# EAGLE design Schematics_Rev_2 (EAGLE 9.3.0)
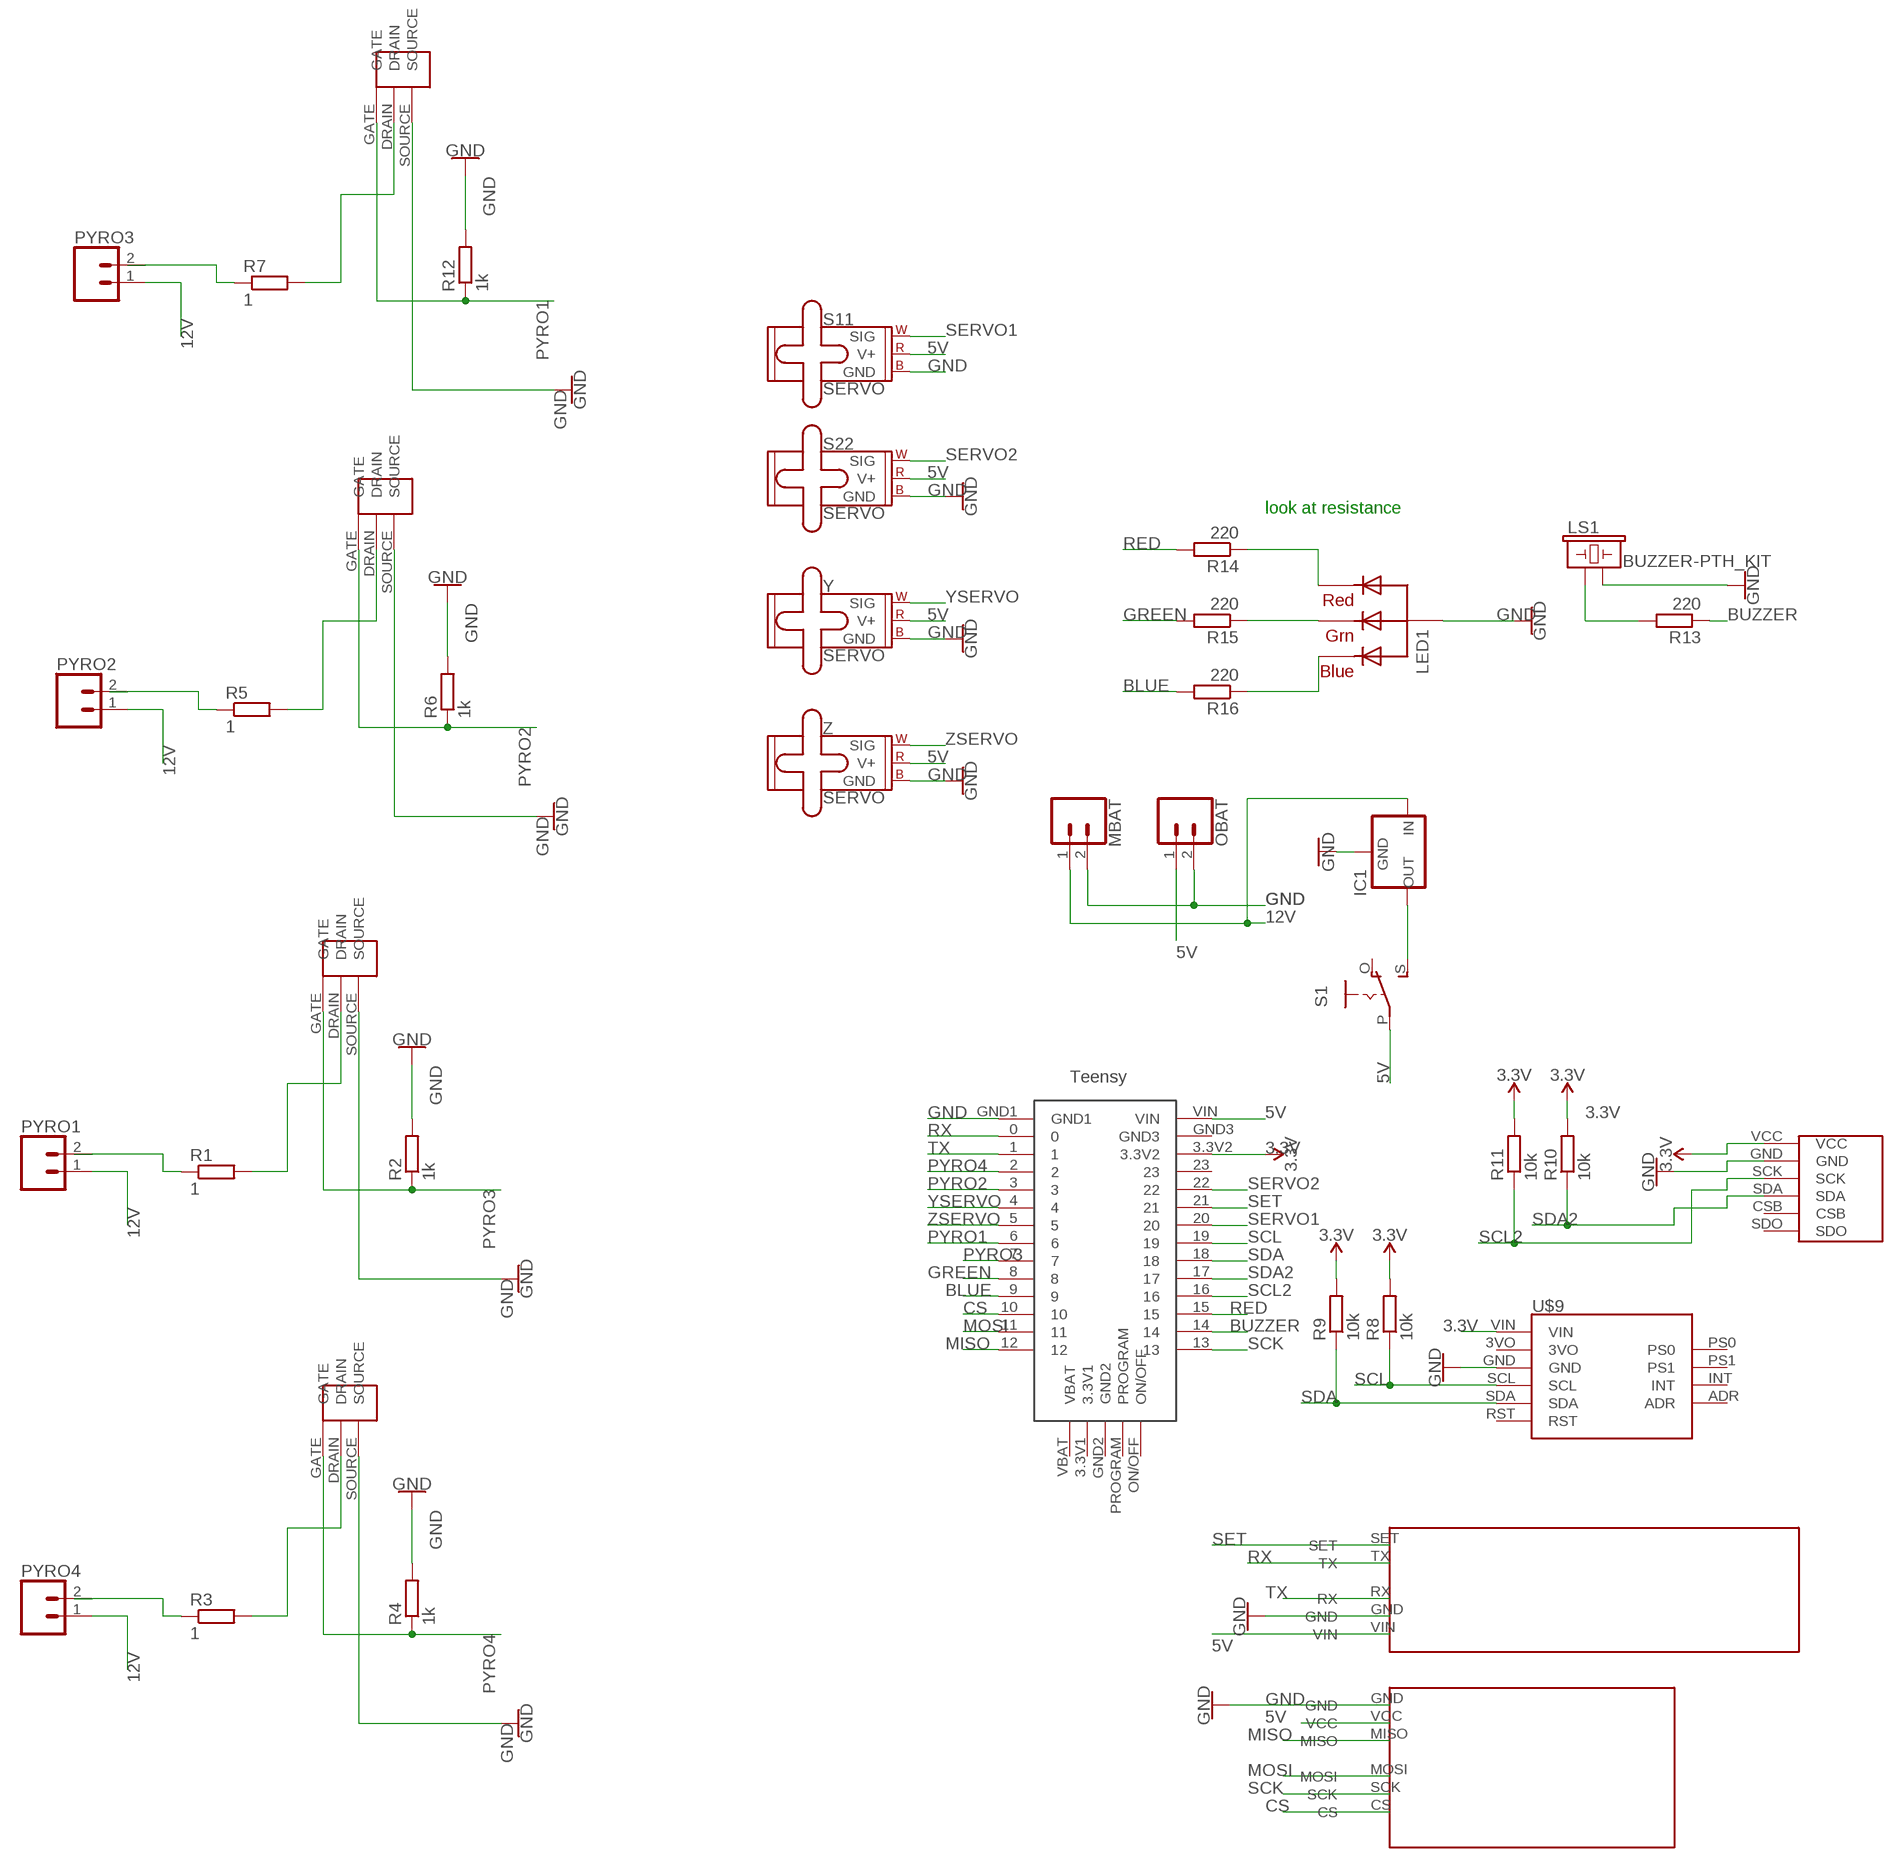
[diagram p0: schematic, sheet 1]

## Parts
IC1  78XXS  [78XXS]
LED1  RGBLED_CA-5MM  [LED5MMRGB]
LS1  BUZZER-PTH_KIT  [BUZZER-12MM-KIT]
MBAT  CONN_023.5MM  [SCREWTERMINAL-3.5MM-2]
OBAT  CONN_023.5MM  [SCREWTERMINAL-3.5MM-2]
PYRO1  CONN_023.5MM  [SCREWTERMINAL-3.5MM-2]
PYRO2  CONN_023.5MM  [SCREWTERMINAL-3.5MM-2]
PYRO3  CONN_023.5MM  [SCREWTERMINAL-3.5MM-2]
PYRO4  CONN_023.5MM  [SCREWTERMINAL-3.5MM-2]
R1  1  R-EU_0204/7  [0204/7]
R2  1k  R-EU_0204/7  [0204/7]
R3  1  R-EU_0204/7  [0204/7]
R4  1k  R-EU_0204/7  [0204/7]
R5  1  R-EU_0204/7  [0204/7]
R6  1k  R-EU_0204/7  [0204/7]
R7  1  R-EU_0204/7  [0204/7]
R8  10k  R-EU_0204/7  [0204/7]
R9  10k  R-EU_0204/7  [0204/7]
R10  10k  R-EU_0204/7  [0204/7]
R11  10k  R-EU_0204/7  [0204/7]
R12  1k  R-EU_0204/7  [0204/7]
R13  220  R-EU_0204/7  [0204/7]
R14  220  R-EU_0204/7  [0204/7]
R15  220  R-EU_0204/7  [0204/7]
R16  220  R-EU_0204/7  [0204/7]
S1  EG1218S  [EG1218]
S11  SERVO  [1X03]
S22  SERVO  [1X03]
U$1  TEENSY-4.0  [TEENSY-4.0]
U$2  MICROSD  [MICROSD]
U$3  BMP280  [BMP280]
U$4  HC-12  [HC-12]
U$5  IRF520  [IRF520]
U$6  IRF520  [IRF520]
U$7  IRF520  [IRF520]
U$8  IRF520  [IRF520]
U$9  BNO-055  [BNO-055]
Y  SERVO  [1X03]
Z  SERVO  [1X03]

## Nets
3.3V: R8.2 R9.2 R10.2 R11.2 U$1.3.3V2 U$3.VCC U$9.VIN
5V: OBAT.1 S1.P S11.2(V+) S22.2(V+) U$1.VIN U$2.VCC U$4.VIN Y.2(V+) Z.2(V+)
12V: IC1.IN MBAT.1 PYRO1.1 PYRO2.1 PYRO3.1 PYRO4.1
29: LS1.+ R13.2
BLUE: R16.2 U$1.9
BUZZER: R13.1 U$1.14
CS: U$1.10 U$2.CS
GND: IC1.GND LED1.2(VCC) LS1.- MBAT.2 OBAT.2 R2.2 R4.2 R6.2 R12.2 S11.3(GND) S22.3(GND) U$1.GND1 U$2.GND U$3.GND U$4.GND U$5.SOURCE U$6.SOURCE U$7.SOURCE U$8.SOURCE U$9.GND Y.3(GND) Z.3(GND)
GREEN: R15.2 U$1.8
MISO: U$1.12 U$2.MISO
MOSI: U$1.11 U$2.MOSI
N$1: PYRO1.2 R1.1
N$2: R1.2 U$6.DRAIN
N$3: PYRO4.2 R3.1
N$4: R3.2 U$5.DRAIN
N$5: PYRO2.2 R5.1
N$6: R5.2 U$7.DRAIN
N$7: PYRO3.2 R7.1
N$8: R7.2 U$8.DRAIN
N$9: LED1.1(RED) R14.1
N$10: LED1.3(GREEN) R15.1
N$11: IC1.OUT S1.S
N$12: LED1.4(BLUE) R16.1
PYRO1: R12.1 U$1.6 U$8.GATE
PYRO2: R6.1 U$1.3 U$7.GATE
PYRO3: R2.1 U$1.7 U$6.GATE
PYRO4: R4.1 U$1.2 U$5.GATE
RED: R14.2 U$1.15
RX: U$1.0 U$4.TX
SCK: U$1.13 U$2.SCK
SCL: R8.1 U$1.19 U$9.SCL
SCL2: R11.1 U$1.16 U$3.SCK
SDA: R9.1 U$1.18 U$9.SDA
SDA2: R10.1 U$1.17 U$3.SDA
SERVO1: S11.1(SIG) U$1.20
SERVO2: S22.1(SIG) U$1.22
SET: U$1.21 U$4.SET
TX: U$1.1 U$4.RX
YSERVO: U$1.4 Y.1(SIG)
ZSERVO: U$1.5 Z.1(SIG)
Unconnected: S1.O U$1.3.3V1 U$1.23 U$1.GND2 U$1.GND3 U$1.ON/OFF U$1.PROGRAM U$1.VBAT U$3.CSB U$3.SDO U$9.3VO U$9.ADR U$9.INT U$9.PS0 U$9.PS1 U$9.RST

## Notes on the sheet
- look at resistance

## Library data of the parts
IC1 = v-reg:78XXS: VOLTAGE REGULATOR
LED1 = adafruit:RGBLED_CA: RGB LED, common-anode 5MM Staggered pins 5mm Piranha package http://www.ladyada.net/library/pcb/eaglelibrary.html
LS1 = SparkFun-Electromechanical:BUZZER: Buzzer Small round buzzers that operate around the audible 2kHz range. You can use these as speakers to create simple music or user interfaces. Variant Overview: PTH - Mini Speaker - PC Mount 12mm 2.048kHz <https://www.sparkfun.com/products/7950> PTH_KIT - Mini Speaker - PC Mount 12mm 2.048kHz <https://www.sparkfun.com/products/7950> KIT simplifies soldering by adding stop mask to one side of the pads. PTH_NO_SILK - Mini Speaker - PC Mount 12mm 2.048kHz <https://www.sparkfun.com/products/7950> No silkscreen indicator of buzzer outline. PTH_KIT_NO_SILK - Mini Speaker - PC Mount 12mm 2.048kHz <https://www.sparkfun.com/products/7950> KIT package w/o silkscreen SMD - Buzzer Audio Magnetic (CCV-084B16) SMD buzzer used on, e.g. the LilyPad Buzzer <https://www.sparkfun.com/products/8463> and RFID USB Reader <https://www.sparkfun.com/products/9963>. SMD_KIT - Buzzer Audio Magnetic (CCV-084B16) SMD Buzzer with elongated pins to make soldering easier. Used on the SparkFun Simon Says - Surface Mount Soldering Kit <https://www.sparkfun.com/products/10935>.; PROD_ID: COMP-08253; SF_SKU: COM-07950
MBAT OBAT PYRO1-PYRO4 = SparkFun-Retired:CONN_02: Multi connection point. Often used as Generic Header-pin footprint for 0.1 inch spaced/style header connections On any of the 0.1 inch spaced packages, you can populate with these: Break Away Headers - Straight <https://www.sparkfun.com/products/116> (PRT-00116) Break Away Male Headers - Right Angle <https://www.sparkfun.com/products/553> (PRT-00553) Female Headers <https://www.sparkfun.com/products/115> (PRT-00115) Break Away Headers - Machine Pin <https://www.sparkfun.com/products/117> (PRT-00117) Break Away Female Headers - Swiss Machine Pin <https://www.sparkfun.com/products/743> (PRT-00743) For SCREWTERMINALS and SPRING TERMINALS visit here: Screw Terimnals on SparkFun.com <https://www.sparkfun.com/search/results?term=Screw+Terminals> (5mm/3.5mm/2.54mm spacing) This device is also useful as a general connection point to wire up your design to another part of your project. Our various solder wires solder well into these plated through hole pads. Hook-Up Wire - Assortment (Stranded, 22 AWG) <https://www.sparkfun.com/products/11375> (PRT-11375) Hook-Up Wire - Assortment (Solid Core, 22 AWG) <https://www.sparkfun.com/products/11367> (PRT-11367) View the entire wire category on our website here <https://www.sparkfun.com/categories/141> Special notes: Molex polarized connector foot print use with: PRT-08233 with associated crimp pins and housings. 2.54_SCREWTERM for use with PRT-10571. 3.5mm Screw Terminal footprints for PRT-08084 5mm Screw Terminal footprints for use with PRT-08432; PROD_ID: CONN-08399
R1-R16 = rcl:R-EU_: RESISTOR, European symbol; SPICEPREFIX: R
S1 = adafruit:EG1218: SLIDING SWITCH 0.1" spacing through hole, vertical SPDT slide switch http://www.ladyada.net/library/pcb/eaglelibrary.html
S11 S22 Y Z = SparkFun-Electromechanical:SERVO: Servo Motor 3-pin connector for a standard servo motor (voltage supply, ground, and control signal.) SparkFun Products Servo - Generic (Sub-Micro Size) <https://www.sparkfun.com/products/9065> (ROB-09065) Servo - Generic High Torque Continuous Rotation (Standard Size) <https://www.sparkfun.com/products/9347> (ROB-09347) Servo - Generic High Torque (Standard Size) <https://www.sparkfun.com/products/11965> (ROB-11965)
U$1 = Endeavour-PCB:TEENSY-4.0
U$2 = microsd:MICROSD
U$3 = BMP280:BMP280
U$4 = hc-12:HC-12
U$5-U$8 = IRF520:IRF520
U$9 = Endeavour-PCB:BNO-055

## Board
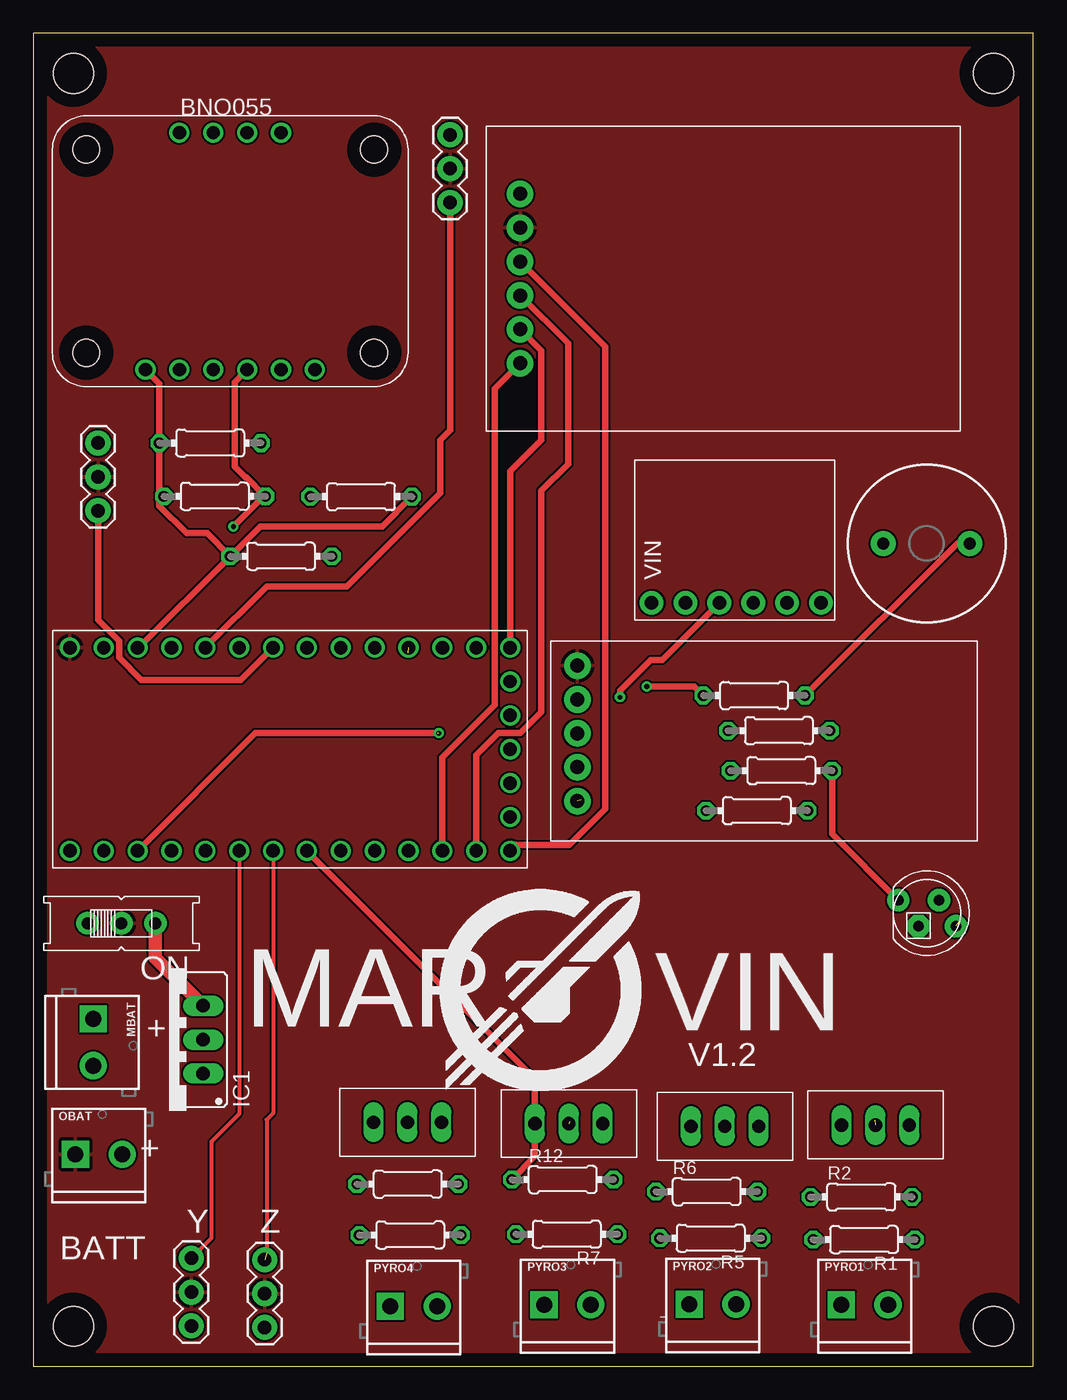
[diagram p1: board, top side]
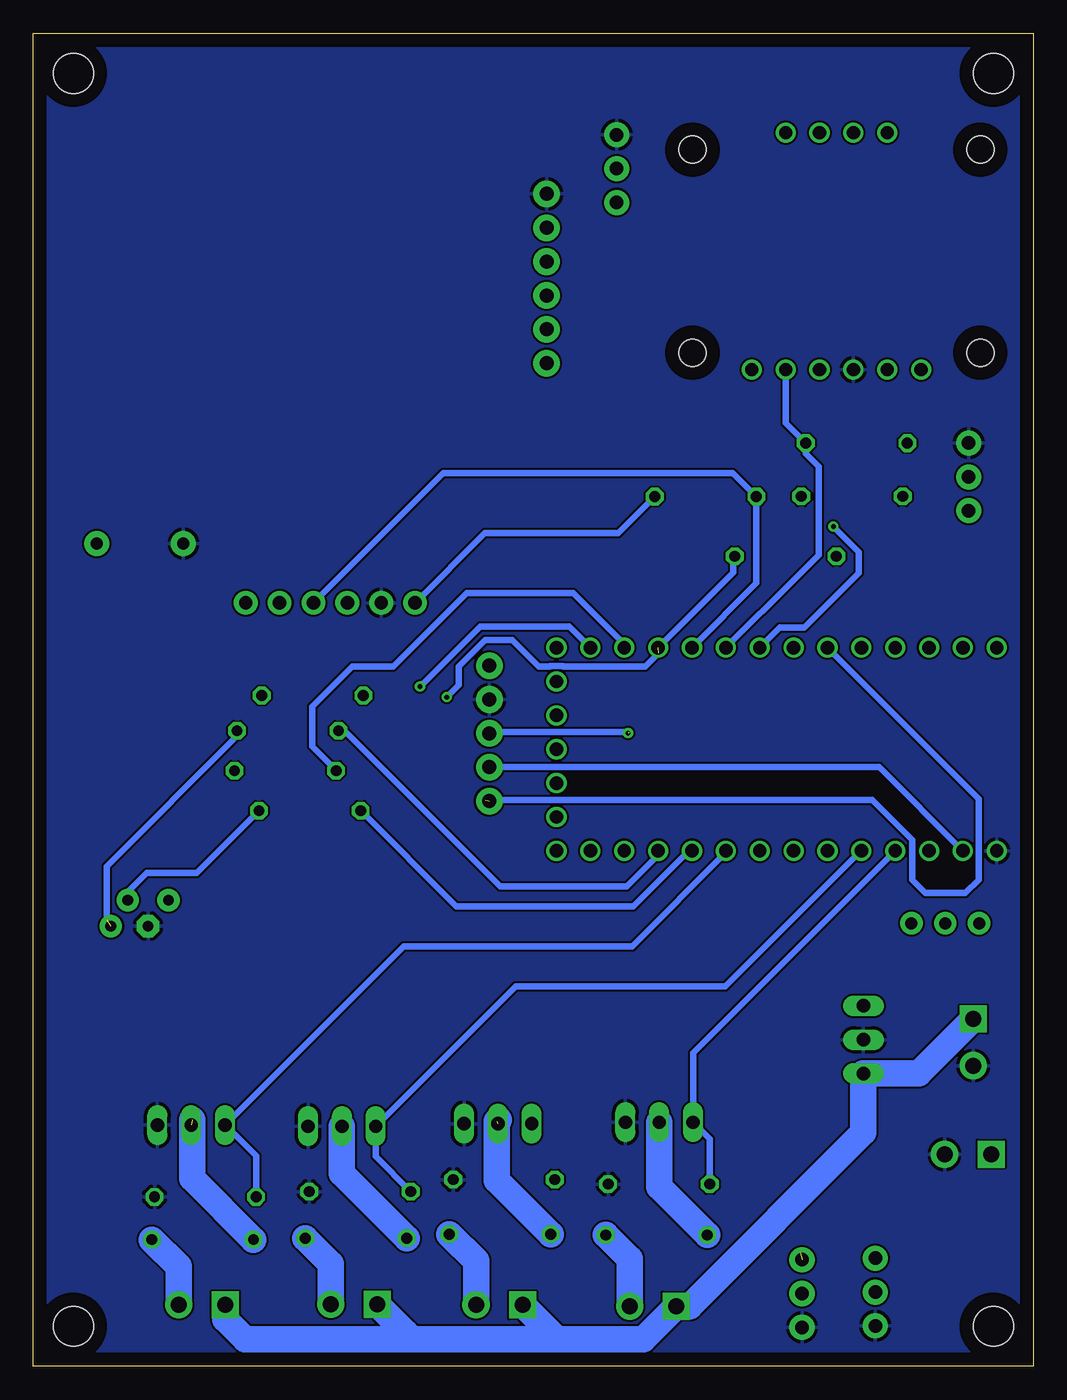
[diagram p2: board, bottom side, seen from below]

Size 75 x 100 mm. Coordinates in mm from the lower left corner, seen from the top.
Outline: 0,0 75,0 75,100 0,100 0,0
Copper layers (1*16): Top 0.035mm / dielectric 1.5mm / Bottom 0.035mm
Design rules "default": minimum track width 6mil, minimum drill 0.35mm, track to track 6mil, track to pad 6mil, pad to pad 6mil, via to via 6mil, smd to smd 6mil, copper to edge 40mil, drill to drill 6mil, minimum pad ring 10mil, minimum via ring 8mil, stop-mask expansion 4mil, vias tented up to drill 0mil, thermal gap 10mil
Holes 3 mm at 3,3 72,3 72,97 3,97

### Footprints (pad centres in the part's own frame; a part is rotated, then mirrored left to right if it is on the bottom)
78XXS = drill 1.016 long: GND 0,-2.54; IN -2.54,-2.54; OUT 2.54,-2.54
LED5MMRGB = drill 0.8 pad 1.676: 1 -2.159,0.968; 3 0.889,0.968; 4 2.159,-0.968 | drill 0.8 pad 1.676 octagon: 2 -0.635,-0.968
BUZZER-12MM-KIT = drill 0.9 pad 1.88: + 3.25,0; - -3.25,0
SCREWTERMINAL-3.5MM-2 = drill 1.2 pad 2.032 square: 1 0,0 | drill 1.2 pad 2.032: 2 3.5,0
0204/7 = drill 0.813 octagon: 1 -3.81,0; 2 3.81,0
EG1218 = drill 0.9 pad 1.676: O -2.54,0; P 0,0; S 2.54,0
1X03 = drill 1.016 pad 1.88: 1 0,0; 2 2.54,0; 3 5.08,0
TEENSY-4.0 = drill 1: 0 3.81,1.27; 1 6.35,1.27; 2 8.89,1.27; 3 11.43,1.27; 3.3V1 34.29,6.35; 3.3V2 6.35,16.51; 4 13.97,1.27; 5 16.51,1.27; 6 19.05,1.27; 7 21.59,1.27; 8 24.13,1.27; 9 26.67,1.27; 10 29.21,1.27; 11 31.75,1.27; 12 34.29,1.27; 13 34.29,16.51; 14 31.75,16.51; 15 29.21,16.51; 16 26.67,16.51; 17 24.13,16.51; 18 21.59,16.51; 19 19.05,16.51; 20 16.51,16.51; 21 13.97,16.51; 22 11.43,16.51; 23 8.89,16.51; GND1 1.27,1.27; GND2 34.29,8.89; GND3 3.81,16.51; ON/OFF 34.29,13.97; PROGRAM 34.29,11.43; VBAT 34.29,3.81; VIN 1.27,16.51
MICROSD = drill 1.05 pad 2: CS 0,0; GND 0,12.7; MISO 0,7.62; MOSI 0,5.08; SCK 0,2.54; VCC 0,10.16
BMP280 = drill 1 pad 1.784: CSB 11.43,1.27; GND 3.81,1.27; SCK 6.35,1.27; SDA 8.89,1.27; SDO 13.97,1.27; VCC 1.27,1.27
HC-12 = drill 1.05 pad 2: GND 0,7.62; RX 0,5.08; SET 0,0; TX 0,2.54; VIN 0,10.16
IRF520 = drill 1 long: DRAIN 0,2.54; GATE 0,5.08; SOURCE 0,0
BNO-055 = drill 1: 3VO -17.145,1.27; ADR -9.525,19.05; GND -14.605,1.27; INT -12.065,19.05; PS0 -17.145,19.05; PS1 -14.605,19.05; RST -6.985,1.27; SCL -12.065,1.27; SDA -9.525,1.27; VIN -19.685,1.27 | hole 2.032: -24.13,17.78; -2.54,17.78; -2.54,2.54; -24.13,2.54

### Placement (x,y rotation side)
IC1  10.2,24.5 90 top
LED1  67.03,33.99 0 top
LS1  66.99,61.73 0 top
MBAT  4.5,26.05 270 top
OBAT  3.16,15.9 0 top
PYRO1  60.6,4.6 0 top
PYRO2  49.2,4.65 0 top
PYRO3  38.3,4.6 0 top
PYRO4  26.78,4.5 0 top
R1  62.3,9.5 180 top
R2  62.1,12.7 0 top
R3  28.26,9.84 180 top
R4  28.08,13.66 0 top
R5  50.8,9.6 180 top
R6  50.5,13.1 0 top
R7  40,9.9 180 top
R8  13.6,65.26 180 top
R9  13.26,69.26 180 top
R10  24.58,65.24 0 top
R11  18.58,60.76 180 top
R12  39.7,14 0 top
R13  54.06,50.32 0 top
R14  56.1,44.68 180 top
R15  54.26,41.68 180 top
R16  55.92,47.68 180 top
S1  6.61,33.23 0 top
S11  4.85,64.18 90 top
S22  31.25,87.31 90 top
U$1  1.47,37.4 0 top
U$2  36.51,75.25 0 top
U$3  45.1,56 0 top
U$4  40.8,42.4 0 top
U$5  30.6,18.3 90 top
U$6  65.7,18.1 90 top
U$7  54.4,18 90 top
U$8  42.7,18.2 90 top
U$9  28.1,73.5 0 top
Y  11.85,8.1 270 top
Z  17.35,7.99 270 top

### Tracks (layer width: path | path; a pad name or v marks a point on that pad's centre or on a via)
3.3V
  Top 0.5: U$1.3.3V2 7.91,53.91 R11.2 | R11.2 13.03,62.5 11.5,62.5 9.45,64.55 R9.2 | R9.2 9.45,65.6 R8.2 | R11.2 17.01,63 26.15,63 R10.2 | R9.2 9.45,73.73 U$9.VIN
  Bottom 0.5: R10.2 31.13,62.5 41.14,62.5 U$3.VCC
5V
  pour Top: -3,4 -3,-6 -4.5,-7.5 83.5,-7.5 86,-10 86,112 88,114 -8,114 -11.5,110.5 -11.5,12.5
12V
  Bottom 2: MBAT.1 8.59,21.96 IC1.IN 12.74,17.54 25.78,4.5 PYRO4.1 29.26,2.02 35.72,2.02 | 35.72,2.02 47.1,2.02 | 47.1,2.02 59.1,2.02 60.6,3.52 PYRO1.1 | PYRO3.1 35.72,2.02 | PYRO2.1 47.1,2.55 47.1,2.02
29
  Top 0.5: LS1.+ 69.28,61.73 R13.2
BLUE
  Bottom 0.5: R16.2 51.68,47.68 40,36 30.5,36 28.14,38.36 U$1.9
BUZZER  (via drill 0.35)
  Top 0.5: v46,51 49.57,51 R13.1
  Bottom 0.5: U$1.14 34.81,55.5 41.5,55.5 v46,51
CS
  Top 0.5: U$1.10 30.68,45.68 34.6,49.6 34.6,73.34 U$2.CS
GND
  pour Bottom: -5.5,12.5 -5.5,-4 90.5,-4 90.5,99 91,99.5 73.5,117 -5,117 -10.5,111.5 -10.5,17.5
GREEN
  Bottom 0.5: R15.2 43.27,34.5 30,34.5 25.83,38.67 U$1.8
MISO
  Top 0.5: 35.76,38.74 U$1.12 36.19,39.1 40.2,39.1 42.9,41.8 42.9,76.48 U$2.MISO
MOSI
  Top 0.5: U$1.11 33.22,45.85 34.87,47.5 36.5,47.5 38.1,49.1 38.1,65.7 40.1,67.7 40.1,76.74 U$2.MOSI
N$1
  Bottom 2: PYRO1.2 64.1,7.49 R1.1
N$2  (1 unrouted)
  Bottom 2: R1.2 63.1,14.11 63.1,18.5
N$3
  Bottom 2: PYRO4.2 30.28,8.05 R3.1
N$4
  Bottom 2: R3.2 28.06,13.45 U$5.DRAIN
N$5
  Bottom 2: PYRO2.2 52.7,7.69 R5.1
N$6
  Bottom 2: R5.2 51.86,14.47 U$7.DRAIN
N$7
  Bottom 2: PYRO3.2 41.8,7.89 R7.1
N$8  (1 unrouted)
  Bottom 2: R7.2 40.24,13.95 40.24,18.36 40.1,18.5
N$9
  Top 0.5: LED1.1 59.91,39.92 R14.1
N$10
  Bottom 0.5: R15.1 62.75,37 66.5,37 67.92,35.58 LED1.3
N$11
  Top 1: IC1.OUT 9.15,30.63 S1.S
N$12  (1 unrouted)
  Bottom 0.5: R16.1 59.73,47.27 69.5,37.5 69.5,33.5
PYRO1
  Top 0.5: U$1.6 37.62,21.57 U$8.GATE 37.62,15.73 R12.1
PYRO2
  Bottom 0.5: R6.1 49.32,15.73 U$7.GATE 38.82,28.5 23.1,28.5 12.93,38.67 U$1.3
PYRO3
  Bottom 0.5: R2.1 58.29,15.77 U$6.GATE 47.22,31.5 30.1,31.5 23.06,38.54 U$1.7
PYRO4
  Bottom 0.5: 24.16,13.66 R4.1 24.27,17.05 U$5.GATE 25.52,23.51 U$1.2
RED
  Bottom 0.5: U$1.15 30.68,54.18 34.5,58 42.5,58 48,52.5 51.1,52.5 54.1,49.5 54.1,46.49 R14.2
RX
  Bottom 0.5: U$1.0 11.55,44.94 U$4.TX
SCK
  Top 0.5: U$2.SCK 38.1,76.2 38.1,69.5 35.76,67.16 U$1.13
SCL  (via drill 0.35)
  Top 0.5: v15,63 17.26,65.26 R8.1 16.01,66.66 15.94,66.66 15.1,67.5 15.1,73.83 U$9.SCL
  Bottom 0.5: U$1.19 19.02,55.41 17.19,55.41 13.1,59.5 13.1,61.1 v15,63 | 17.14,65.53 R8.1
SCL2  (via drill 0.35)  (1 unrouted)
  Top 0.5: U$3.SCK 47.18,53 46.3,53 44,50.7 v44,50.2
  Bottom 0.5: R11.1 22.5,60.76 22.5,59.55 U$1.16 | 28.1,53.5 29.1,52.5 35.26,52.5 35.28,52.53 36.24,52.53 36.27,52.5 37.1,52.5 39.1,54.5 41.1,54.5 43.1,52.5 43.1,51.1 v44,50.2
SDA
  Bottom 0.5: U$1.18 17.79,59.19 17.41,59.56 16.1,60.87 16.1,67.5 17.07,68.47 R9.1 18.58,70.77 U$9.SDA
SDA2
  Bottom 0.5: U$1.17 20.77,58.74 R10.1 22.53,67 27.5,67 28.1,67 44.26,67 U$3.SDA
SERVO1
  Top 0.5: U$1.20 15.57,51.5 8.1,51.5 6.44,53.16 6.44,54.39 4.85,55.98 S11.1
SERVO2
  Top 0.5: U$1.22 17.49,58.5 23.5,58.5 30.5,65.5 30.5,69.5 31.25,70.25 S22.1
SET  (1 unrouted)
  Bottom 0.3: 4.1,42.57 4.1,42.5
  Bottom 0.5: 41.1,42.5 12.1,42.5 9.1,39.5 9.1,36.5 8.1,35.5 5.1,35.5 4.1,36.5 4.1,42.5 | U$1.21 4.1,42.57
TX  (via drill 0.35)  (1 unrouted)
  Top 0.5: U$1.1 16.65,47.5 30.3,47.5
  Bottom 0.5: v30.4,47.5 30.5,47.6 40.68,47.6 U$4.RX
YSERVO
  Top 0.3: Y.1 13.35,9.6 13.35,16.85 15.44,18.94 U$1.4
ZSERVO  (1 unrouted)
  Top 0.3: U$1.5 17.98,18.98 17.5,18.5 17.5,8.5

### Text on the board
tPlace: ON | MAR | VIN | + | V1.2 | + | Y | Z | BATT